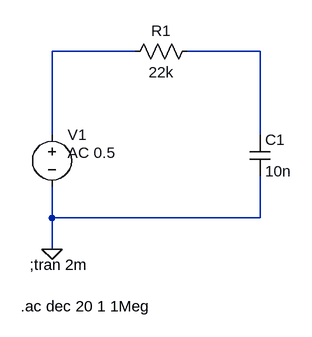
[diagram p0: schematic aufgabe1_tiefpass.asc]
aufgabe1_tiefpass.asc, the LTspice schematic file:
Version 4
SHEET 1 880 680
WIRE 496 -672 368 -672
WIRE 688 -672 576 -672
WIRE 368 -544 368 -672
WIRE 688 -544 688 -672
WIRE 368 -416 368 -464
WIRE 688 -416 688 -480
WIRE 688 -416 368 -416
WIRE 368 -368 368 -416
FLAG 368 -368 0
SYMBOL voltage 368 -560 R0
WINDOW 123 24 44 Left 2
WINDOW 39 0 0 Left 2
SYMATTR InstName V1
SYMATTR Value ""
SYMATTR Value2 AC 0.5
SYMBOL res 592 -688 R90
WINDOW 0 0 56 VBottom 2
WINDOW 3 32 56 VTop 2
SYMATTR InstName R1
SYMATTR Value 22k
SYMBOL cap 672 -544 R0
SYMATTR InstName C1
SYMATTR Value 10n
TEXT 334 -344 Left 2 !;tran 2m
TEXT 320 -280 Left 2 !.ac dec 20 1 1Meg

The netlist it stands for:
* aufgabe1_tiefpass.asc
V1 N001 0 AC 0.5
R1 N002 N001 22k
C1 N002 0 10n
;tran 2m
.ac dec 20 1 1Meg
.backanno
.end